# EAGLE schematic power_selectable_5v_3.3v (EAGLE 6.1)
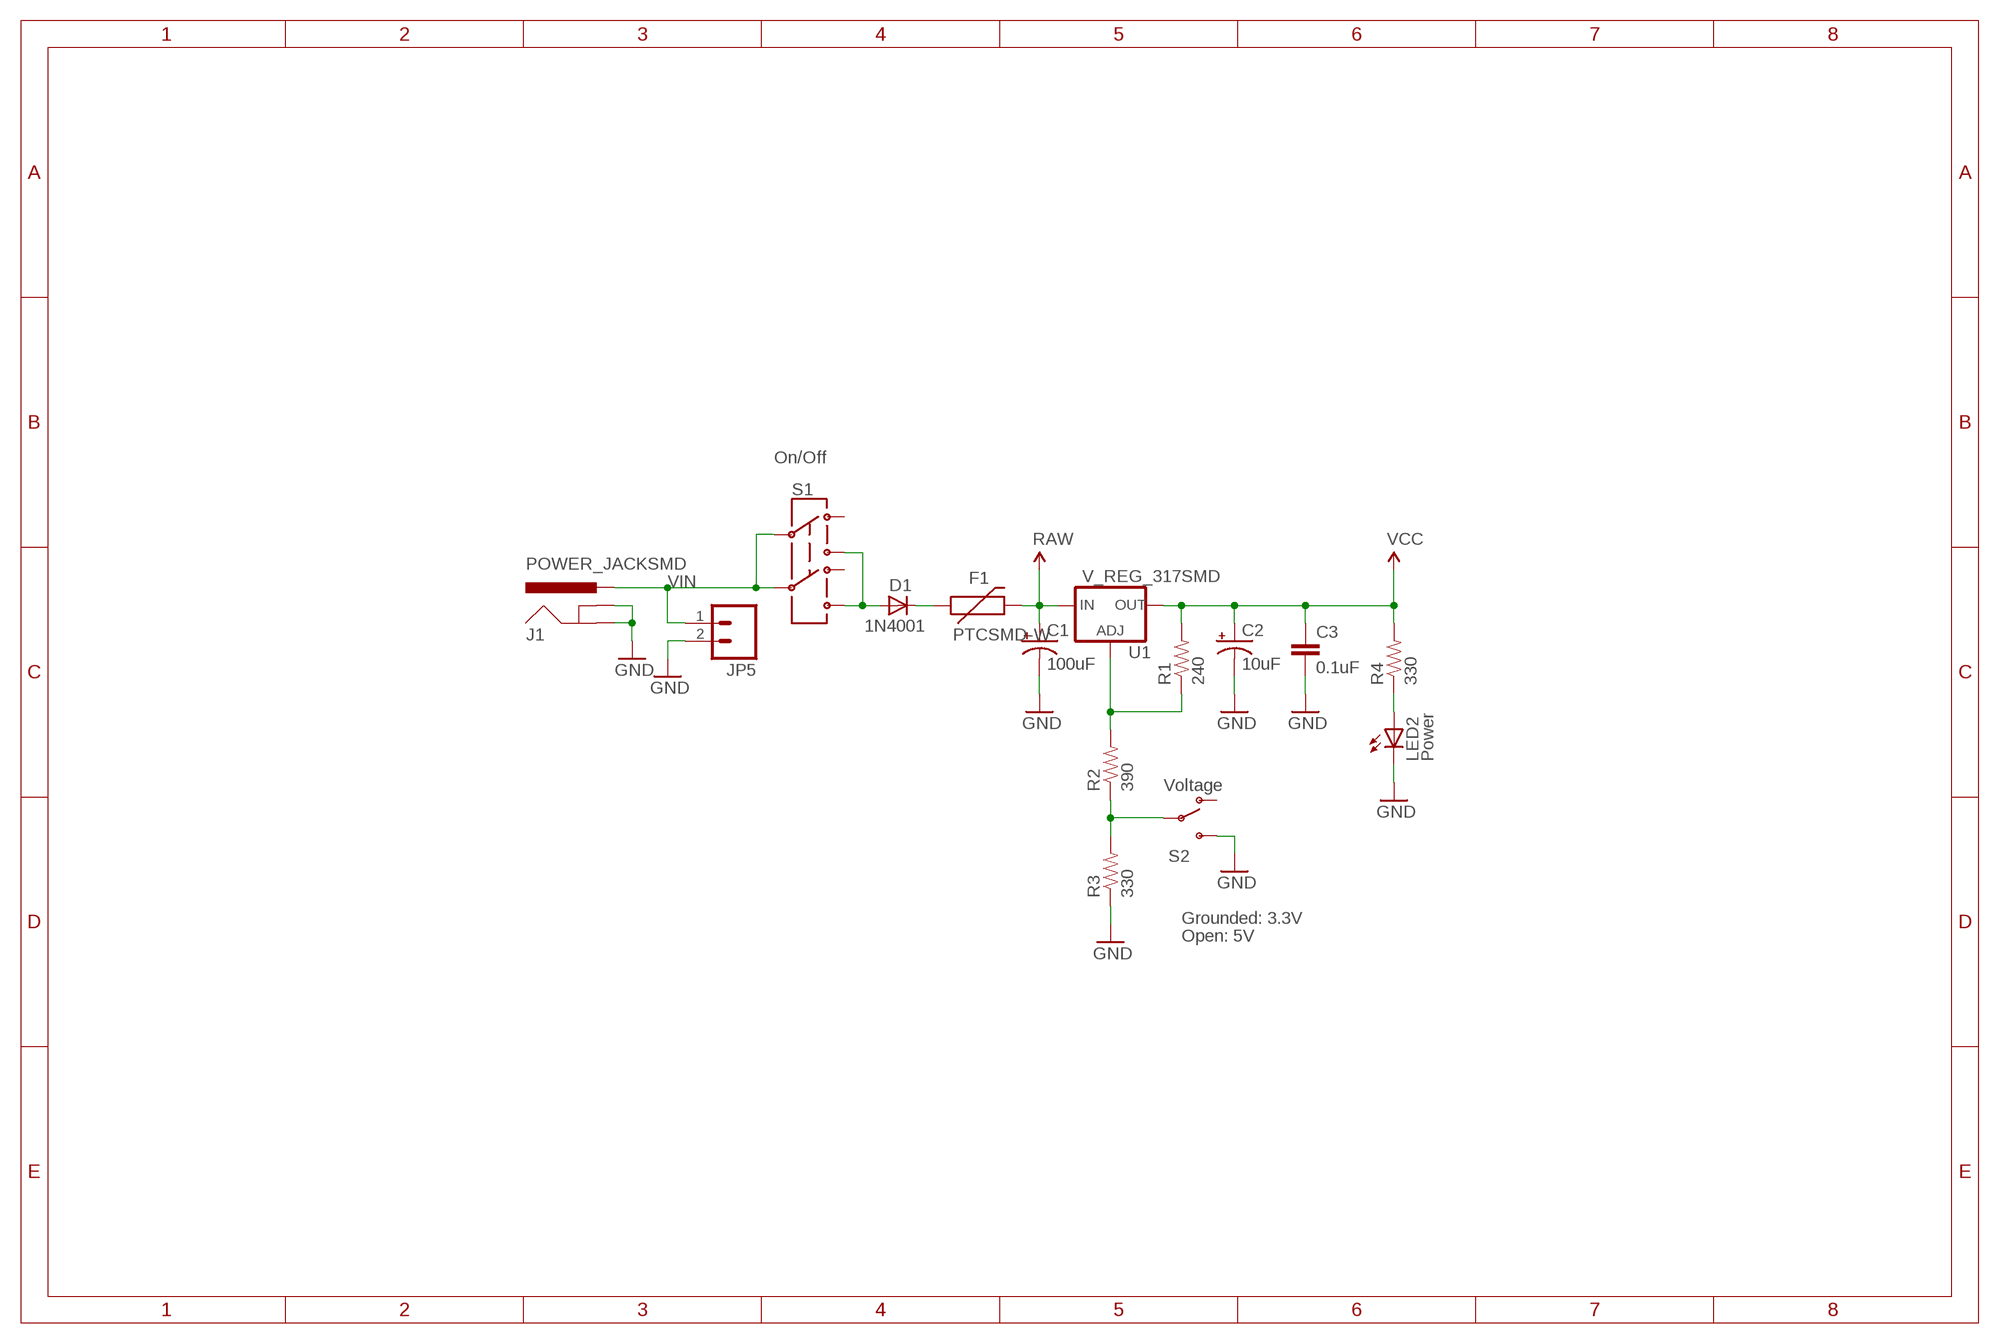
[diagram p0: schematic, sheet 1]

## Parts
C1  100uF  CAP_POL7343  [EIA7343]
C2  10uF  CAP_POL1206  [EIA3216]
C3  0.1uF  CAP0603-CAP  [0603-CAP]
D1  1N4001  DIODESMA-TYLERALT1  [SMA-DIODE-TYLERALT1]
F1  PTCSMD-W  [PTC-1206-WIDE]
J1  POWER_JACKSMD  [POWER_JACK_SMD]
JP5  M02PTH  [1X02]
LED2  Power  LED1206  [LED-1206]
R1  240  RESISTOR0603-RES  [0603-RES]
R2  390  RESISTOR0603-RES  [0603-RES]
R3  330  RESISTOR0603-RES  [0603-RES]
R4  330  RESISTOR0603-RES  [0603-RES]
S1  On/Off  AYZ0202  [AYZ0202]
S2  Voltage  SWITCH-SPSTSMD  [AYZ0202]
U1  V_REG_317SMD  [SOT223]

## Nets
GND: C1.C(-) C2.C(-) C3.2 J1.GND(GNDBREAK) J1.P$4(GND) JP5.2 LED2.C R3.1 S2.3(S)
N$1: D1.C F1.1
N$2: D1.A S1.1 S1.4
N$4: R2.1 R3.2 S2.2(P)
N$5: R1.1 R2.2 U1.1(ADJ)
N$8: LED2.A R4.1
RAW: C1.A(+) F1.2 U1.3(IN)
VCC: C2.A(+) C3.1 R1.2 R4.2 U1.2(OUT)
VIN: J1.VIN0(PWR) JP5.1 S1.2 S1.5
Unconnected: S1.3 S1.6 S2.1(O)

## Notes on the sheet
- Grounded: 3.3V
- Open: 5V

## Library data of the parts
C1 C2 = SparkFun:CAP_POL: Capacitor Polarized These are standard SMD and PTH capacitors. Normally 10uF, 47uF, and 100uF in electrolytic and tantalum varieties. Always verify the external diameter of the through hole cap, it varies with capacity, voltage, and manufacturer. The EIA devices should be standard.
C3 = SparkFun:CAP: Capacitor Standard 0603 ceramic capacitor, and 0.1" leaded capacitor.
D1 = Testing:DIODE: Diode These are standard reverse protection diodes and small signal diodes. SMA package can handle up to about 1A. SOD-323 can handle about 200mA. What the SOD-323 package when ordering, there are some mfgs out there that are 5-pin packages.
F1 = SparkFun-PowerIC:PTC: Resettable Fuse PTC Resettable Fuse. Spark Fun Electronics SKU : COM-08357
J1 = SparkFun-Connectors:POWER_JACK: Power Jack This is the standard 5.5mm barrel jack for power. The PTH is the most common, proven, reliable, footprint. The Slot footprint only works if the mill layer is transmitted to the PCB fab house so be warned. Mating wall wart : TOL-00298 (and others); PROD_ID: CONN-08106; VALUE: 5.5x2.1mm Barrel
JP5 = SparkFun:M02: Header 2 Standard 2-pin 0.1" header. Use with straight break away headers (SKU : PRT-00116), right angle break away headers (PRT-00553), swiss pins (PRT-00743), machine pins (PRT-00117), and female headers (PRT-00115). Molex polarized connector foot print use with SKU : PRT-08233 with associated crimp pins and housings.
LED2 = SparkFun-Nate:LED
R1-R4 = SparkFun:RESISTOR: Resistor Basic schematic elements and footprints for 0603, 1206, and PTH resistors.
S1 = SparkFun:AYZ0202: SPDT Slide Switch Simple SMD single-pull double-throw slide switch. Good for less than 350mA power switch, switching UARTs between devices, etc. Spark Fun Electronics SKU : COM-00597
S2 = SparkFun:SWITCH-SPST: SPST Switch Simple slide switch. Spark Fun Electronics SKU : COM-00102
U1 = SparkFun:V_REG_317: Voltage Regulator Standard LM317 adjustable voltage regulator. AOI (Adjust Output Input). Google 'LM317 Calculator' for easy to use app to get the two resistor values needed. 240/720 for 5V output. 240/390 for 3.3V output. Spark Fun Electronics SKU : COM-00527

## Net classes
0 default: width 0.203 mm